# EAGLE design NHK_bldc (EAGLE 9.6.2)
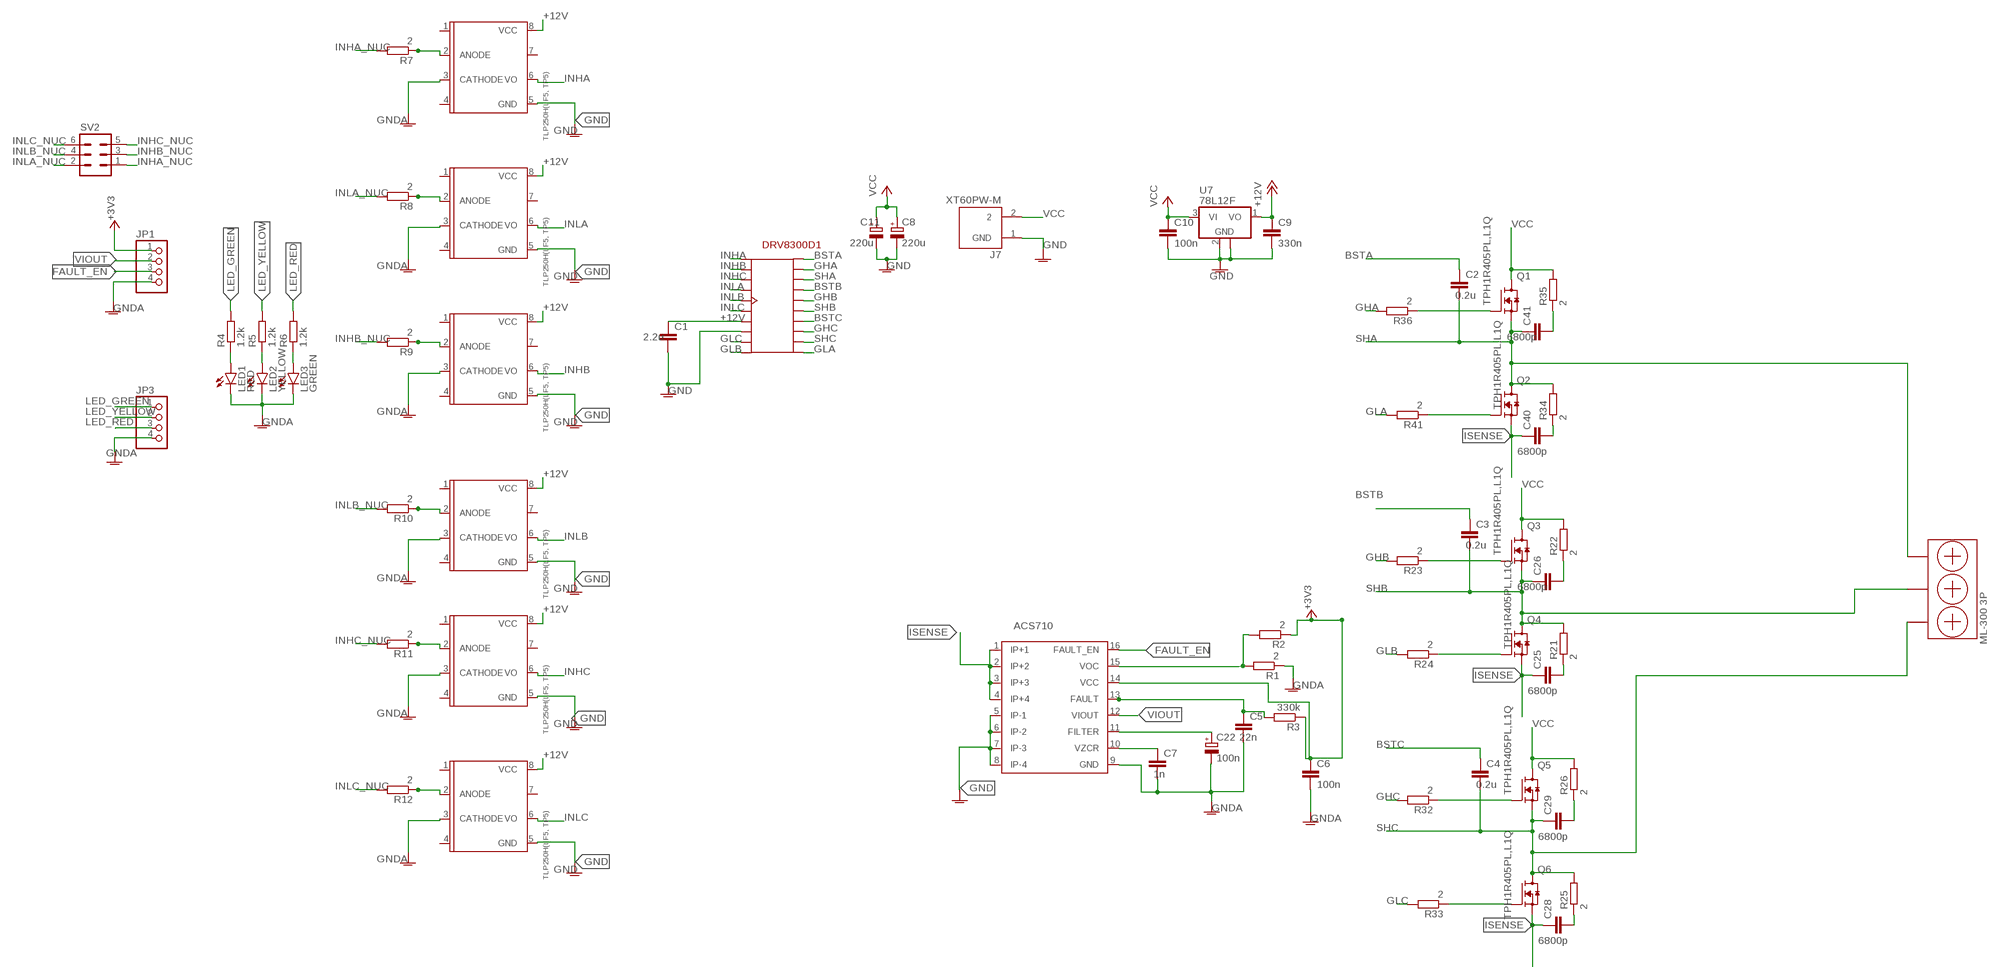
[diagram p0: schematic, sheet 1]

## Parts
C1  2.2u  C-EUC1206  [C1206]
C2  0.2u  C-EUC1206  [C1206]
C3  0.2u  C-EUC1206  [C1206]
C4  0.2u  C-EUC1206  [C1206]
C5  22n  C-EUC0603  [C0603]
C6  100n  C-EUC0603  [C0603]
C7  1n  C-EUC0603  [C0603]
C8  220u  CPOL-EUE5-10.5  [E5-10,5]
C9  330n  C-EUC0603  [C0603]
C10  100n  C-EUC0603  [C0603]
C11  220u  CPOL-EUE5-10.5  [E5-10,5]
C22  100n  CPOL-EUE2.5-5  [E2,5-5]
C25  6800p  C-EUC0603  [C0603]
C26  6800p  C-EUC0603  [C0603]
C28  6800p  C-EUC0603  [C0603]
C29  6800p  C-EUC0603  [C0603]
C40  6800p  C-EUC0603  [C0603]
C41  6800p  C-EUC0603  [C0603]
DRV8300D1  DRV8300D  [DRV8300D]
J7  XT60PW-M  [AMASS_XT60PW-M]
JP1  PINHD-1X4  [1X04]
JP3  PINHD-1X4  [1X04]
LED1  RED  LEDCHIP-LED0603  [CHIP-LED0603]
LED2  YELLOW  LEDCHIP-LED0603  [CHIP-LED0603]
LED3  GREEN  LEDCHIP-LED0603  [CHIP-LED0603]
ML-300-3P1  ML-300-3P  [ML300-3P]
Q1  TPH1R405PL,L1Q  [SOPADVANCE]
Q2  TPH1R405PL,L1Q  [SOPADVANCE]
Q3  TPH1R405PL,L1Q  [SOPADVANCE]
Q4  TPH1R405PL,L1Q  [SOPADVANCE]
Q5  TPH1R405PL,L1Q  [SOPADVANCE]
Q6  TPH1R405PL,L1Q  [SOPADVANCE]
R1  2  R-EU_R0603  [R0603]
R2  2  R-EU_R0603  [R0603]
R3  330k  R-EU_R0603  [R0603]
R4  1.2k  R-EU_R0603  [R0603]
R5  1.2k  R-EU_R0603  [R0603]
R6  1.2k  R-EU_R0603  [R0603]
R7  2  R-EU_R0603  [R0603]
R8  2  R-EU_R0603  [R0603]
R9  2  R-EU_R0603  [R0603]
R10  2  R-EU_R0603  [R0603]
R11  2  R-EU_R0603  [R0603]
R12  2  R-EU_R0603  [R0603]
R21  2  R-EU_R0603  [R0603]
R22  2  R-EU_R0603  [R0603]
R23  2  R-EU_R0603  [R0603]
R24  2  R-EU_R0603  [R0603]
R25  2  R-EU_R0603  [R0603]
R26  2  R-EU_R0603  [R0603]
R32  2  R-EU_R0603  [R0603]
R33  2  R-EU_R0603  [R0603]
R34  2  R-EU_R0603  [R0603]
R35  2  R-EU_R0603  [R0603]
R36  2  R-EU_R0603  [R0603]
R41  2  R-EU_R0603  [R0603]
SV2  MA03-2  [MA03-2]
U7  78L12F  [SOT89]
U8  TLP250H(LF5,TP5)  [TLP250H(LF5,TP5)]
U9  TLP250H(LF5,TP5)  [TLP250H(LF5,TP5)]
U10  TLP250H(LF5,TP5)  [TLP250H(LF5,TP5)]
U11  TLP250H(LF5,TP5)  [TLP250H(LF5,TP5)]
U12  TLP250H(LF5,TP5)  [TLP250H(LF5,TP5)]
U14  TLP250H(LF5,TP5)  [TLP250H(LF5,TP5)]
U$1  ACS710  [ACS710]

## Nets
+3V3: C6.1 JP1.1 R2.1 R3.1 U$1.14(VCC)
+12V: C1.1 C9.1 DRV8300D1.GVDD U7.1(VO) U8.8(VCC) U9.8(VCC) U10.8(VCC) U11.8(VCC) U12.8(VCC) U14.8(VCC)
AHG1: Q1.4(G) R36.1
AHG3: Q3.4(G) R23.1
AHG4: Q5.4(G) R32.1
ALG1: Q2.4(G) R41.1
ALG3: Q4.4(G) R24.1
ALG4: Q6.4(G) R33.1
BSTA: C2.1 DRV8300D1.BSTA
BSTB: C3.1 DRV8300D1.BSTB
BSTC: C4.1 DRV8300D1.BSTC
FAULT_EN: JP1.3 U$1.16(FAULT_EN)
GHA: DRV8300D1.GHA R36.2
GHB: DRV8300D1.GHB R23.2
GHC: DRV8300D1.GHC R32.2
GLA: DRV8300D1.GLA R41.2
GLB: DRV8300D1.GLB R24.2
GLC: DRV8300D1.GLC R33.2
GND: C1.2 C8.- C9.2 C10.2 C11.- DRV8300D1.GND J7.1(GND) U7.2(GND) U7.2@1(GND) U8.5(GND) U9.5(GND) U10.5(GND) U11.5(GND) U12.5(GND) U14.5(GND) U$1.5(IP-1) U$1.6(IP-2) U$1.7(IP-3) U$1.8(IP-4) ; supply symbol labelled GNDA
GNDA: C5.2 C6.2 C7.2 C22.- JP1.4 JP3.4 LED1.C LED2.C LED3.C R1.1 U8.3(CATHODE) U9.3(CATHODE) U10.3(CATHODE) U11.3(CATHODE) U12.3(CATHODE) U14.3(CATHODE) U$1.9(GND)
INHA: DRV8300D1.INHA U8.6(VO)
INHA_NUC: R7.2 SV2.1
INHB: DRV8300D1.INHB U10.6(VO)
INHB_NUC: R9.2 SV2.3
INHC: DRV8300D1.INHC U12.6(VO)
INHC_NUC: R11.2 SV2.5
INLA: DRV8300D1.INLA U9.6(VO)
INLA_NUC: R8.2 SV2.2
INLB: DRV8300D1.INLB U11.6(VO)
INLB_NUC: R10.2 SV2.4
INLC: DRV8300D1.INLC U14.6(VO)
INLC_NUC: R12.2 SV2.6
ISENSE: C25.1 C28.1 C40.1 Q2.1(S) Q2.2(S) Q2.3(S) Q4.1(S) Q4.2(S) Q4.3(S) Q6.1(S) Q6.2(S) Q6.3(S) U$1.1(IP+1) U$1.2(IP+2) U$1.3(IP+3) U$1.4(IP+4)
LED_GREEN: JP3.1 R4.2
LED_RED: JP3.3 R6.2
LED_YELLOW: JP3.2 R5.2
N$1: LED1.A R4.1
N$2: LED2.A R5.1
N$3: R1.2 R2.2 U$1.15(VOC)
N$4: C5.1 R3.2 U$1.13(FAULT)
N$5: C7.1 U$1.10(VZCR)
N$6: LED3.A R6.1
N$7: R7.1 U8.2(ANODE)
N$8: R8.1 U9.2(ANODE)
N$9: R9.1 U10.2(ANODE)
N$10: R10.1 U11.2(ANODE)
N$11: R11.1 U12.2(ANODE)
N$12: R12.1 U14.2(ANODE)
N$17: C22.+ U$1.11(FILTER)
N$36: C25.2 R21.1
N$37: C26.2 R22.1
N$39: C28.2 R25.1
N$40: C29.2 R26.1
N$42: C40.2 R34.1
N$43: C41.2 R35.1
SHA: C2.2 C41.1 DRV8300D1.SHA ML-300-3P1.P$1 Q1.1(S) Q1.2(S) Q1.3(S) Q2.5(D) Q2.6(D) Q2.7(D) Q2.8(D) Q2.9(D) R34.2
SHB: C3.2 C26.1 DRV8300D1.SHB ML-300-3P1.P$3 Q3.1(S) Q3.2(S) Q3.3(S) Q4.5(D) Q4.6(D) Q4.7(D) Q4.8(D) Q4.9(D) R21.2
SHC: C4.2 C29.1 DRV8300D1.SHC ML-300-3P1.P$5 Q5.1(S) Q5.2(S) Q5.3(S) Q6.5(D) Q6.6(D) Q6.7(D) Q6.8(D) Q6.9(D) R25.2
VCC: C8.+ C10.1 C11.+ J7.2 Q1.5(D) Q1.6(D) Q1.7(D) Q1.8(D) Q1.9(D) Q3.5(D) Q3.6(D) Q3.7(D) Q3.8(D) Q3.9(D) Q5.5(D) Q5.6(D) Q5.7(D) Q5.8(D) Q5.9(D) R22.2 R26.2 R35.2 U7.3(VI)
VIOUT: JP1.2 U$1.12(VIOUT)
Unconnected: U8.1 U8.4 U8.7 U9.1 U9.4 U9.7 U10.1 U10.4 U10.7 U11.1 U11.4 U11.7 U12.1 U12.4 U12.7 U14.1 U14.4 U14.7

## Library data of the parts
C1-C7 C9 C10 C25 C26 C28 C29 C40 C41 = rcl:C-EU: CAPACITOR, European symbol; SPICEPREFIX: C
C8 C11 C22 = rcl:CPOL-EU: POLARIZED CAPACITOR, European symbol; SPICEPREFIX: C
DRV8300D1 = DRV8300D:DRV8300D
J7 = con-xt:XT60PW-M; AVAILABILITY: Unavailable; MF: AMASS; MP: XT60PW-M; PACKAGE: Package Analog Devices; PRICE: None
JP1 JP3 = pinhead:PINHD-1X4: PIN HEADER
LED1-LED3 = led:LED: LED OSRAM: - CHIPLED LG R971, LG N971, LY N971, LG Q971, LY Q971, LO R971, LY R971 LH N974, LH R974 LS Q976, LO Q976, LY Q976 LO Q996 - Hyper CHIPLED LW Q18S LB Q993, LB Q99A, LB R99A - SideLED LS A670, LO A670, LY A670, LG A670, LP A670 LB A673, LV A673, LT A673, LW A673 LH A674 LY A675 LS A676, LA A676, LO A676, LY A676, LW A676 LS A679, LY A679, LG A679 - Hyper Micro SIDELED® LS Y876, LA Y876, LO Y876, LY Y876 LT Y87S - SmartLED LW L88C, LW L88S LB L89C, LB L89S, LG L890 LS L89K, LO L89K, LY L89K LS L896, LA L896, LO L896, LY L896 - TOPLED LS T670, LO T670, LY T670, LG T670, LP T670 LSG T670, LSP T670, LSY T670, LOP T670, LYG T670 LG T671, LOG T671, LSG T671 LB T673, LV T673, LT T673, LW T673 LH T674 LS T676, LA T676, LO T676, LY T676, LB T676, LH T676, LSB T676, LW T676 LB T67C, LV T67C, LT T67C, LS T67K, LO T67K, LY T67K, LW E67C LS E67B, LA E67B, LO E67B, LY E67B, LB E67C, LV E67C, LT E67C LW T67C LS T679, LY T679, LG T679 LS T770, LO T770, LY T770, LG T770, LP T770 LB T773, LV T773, LT T773, LW T773 LH T774 LS E675, LA E675, LY E675, LS T675 LS T776, LA T776, LO T776, LY T776, LB T776 LHGB T686 LT T68C, LB T68C - Hyper Mini TOPLED® LB M676 - Mini TOPLED Santana® LG M470 LS M47K, LO M47K, LY M47K Source: http://www.osram.convergy.de LUXEON: - LUMILED® LXK2-PW12-R00, LXK2-PW12-S00, LXK2-PW14-U00, LXK2-PW14-V00 LXK2-PM12-R00, LXK2-PM12-S00, LXK2-PM14-U00 LXK2-PE12-Q00, LXK2-PE12-R00, LXK2-PE12-S00, LXK2-PE14-T00, LXK2-PE14-U00 LXK2-PB12-K00, LXK2-PB12-L00, LXK2-PB12-M00, LXK2-PB14-N00, LXK2-PB14-P00, LXK2-PB14-Q00 LXK2-PR12-L00, LXK2-PR12-M00, LXK2-PR14-Q00, LXK2-PR14-R00 LXK2-PD12-Q00, LXK2-PD12-R00, LXK2-PD12-S00 LXK2-PH12-R00, LXK2-PH12-S00 LXK2-PL12-P00, LXK2-PL12-Q00, LXK2-PL12-R00 Source: www.luxeon.com KINGBRIGHT: KA-3528ASYC Source: www.kingbright.com
ML-300-3P1 = ML-300-3P:ML-300-3P
Q1-Q6 = toshiba:TPH1R405PL,L1Q; SPICEPREFIX: Q
R1-R12 R21-R26 R32-R36 R41 = rcl:R-EU_: RESISTOR, European symbol; SPICEPREFIX: R
SV2 = con-lstb:MA03-2: PIN HEADER; OC_FARNELL: unknown; OC_NEWARK: unknown
U7 = linear:78L*: POSITOIV-VOLTAGE REGULATORS Output up to 100 mA Source: Datasheet <http://focus.ti.com/lit/ds/symlink/ua78l05.pdf>
U8-U12 U14 = TLP250H(LF5, TP5):TLP250H(LF5,TP5)
U$1 = ACS710:ACS710

## Net classes
1 Power: width 0.8 mm, clearance 1 mm
2 FET: width 0.1 mm, clearance 1 mm

## Board
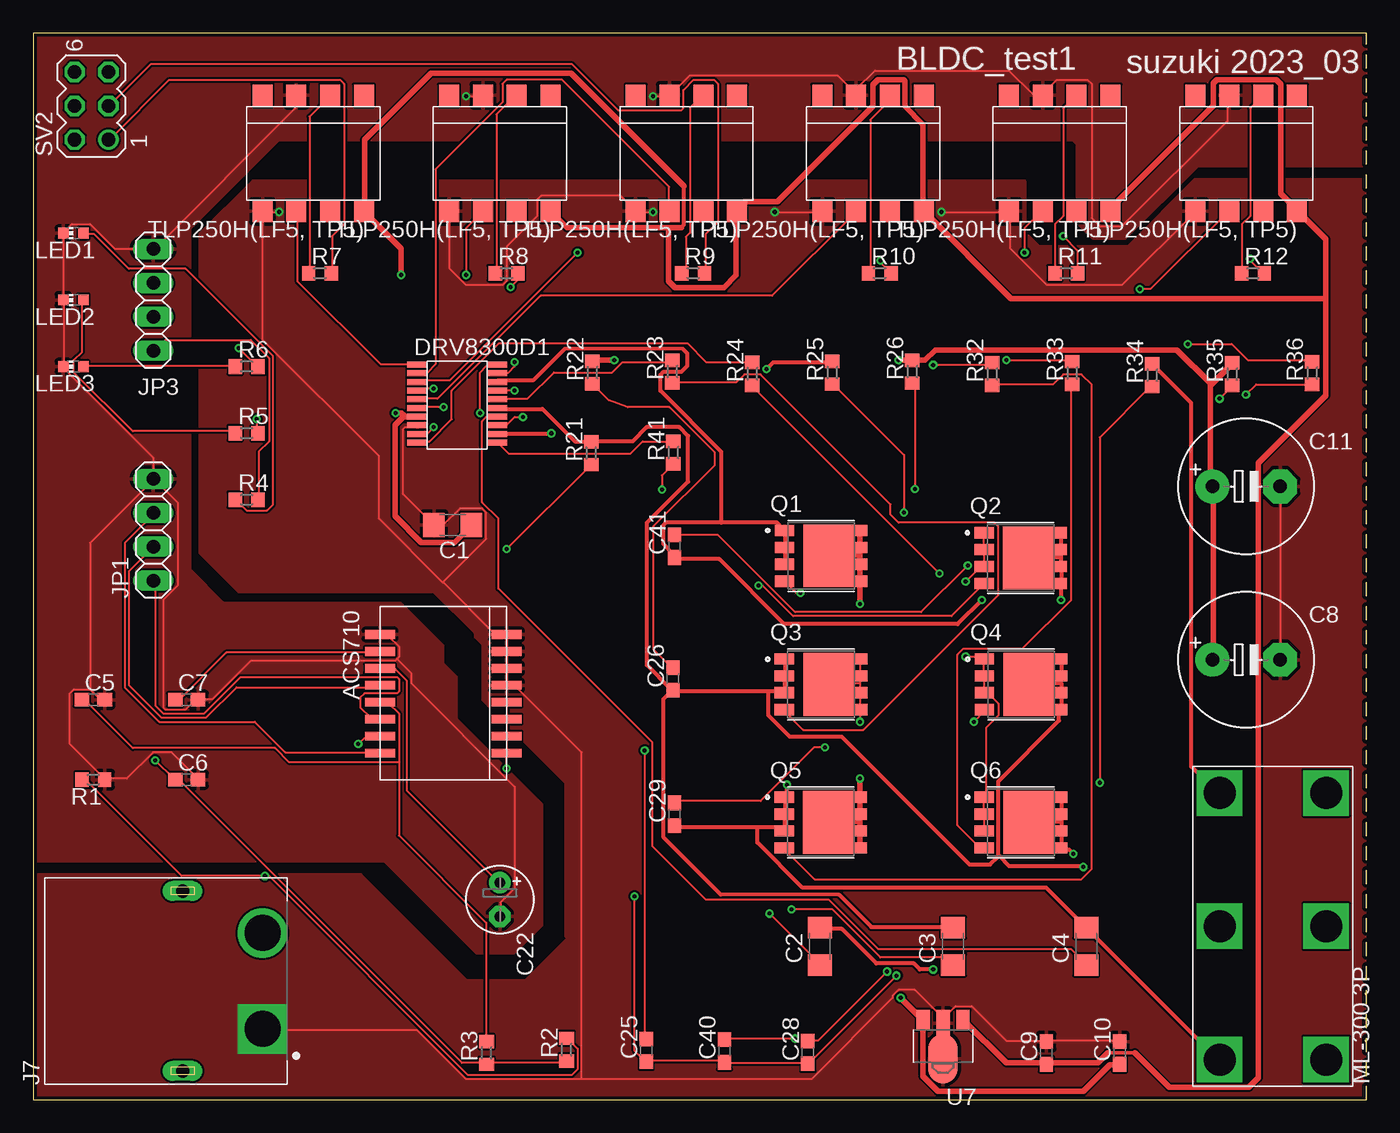
[diagram p1: board, top side]
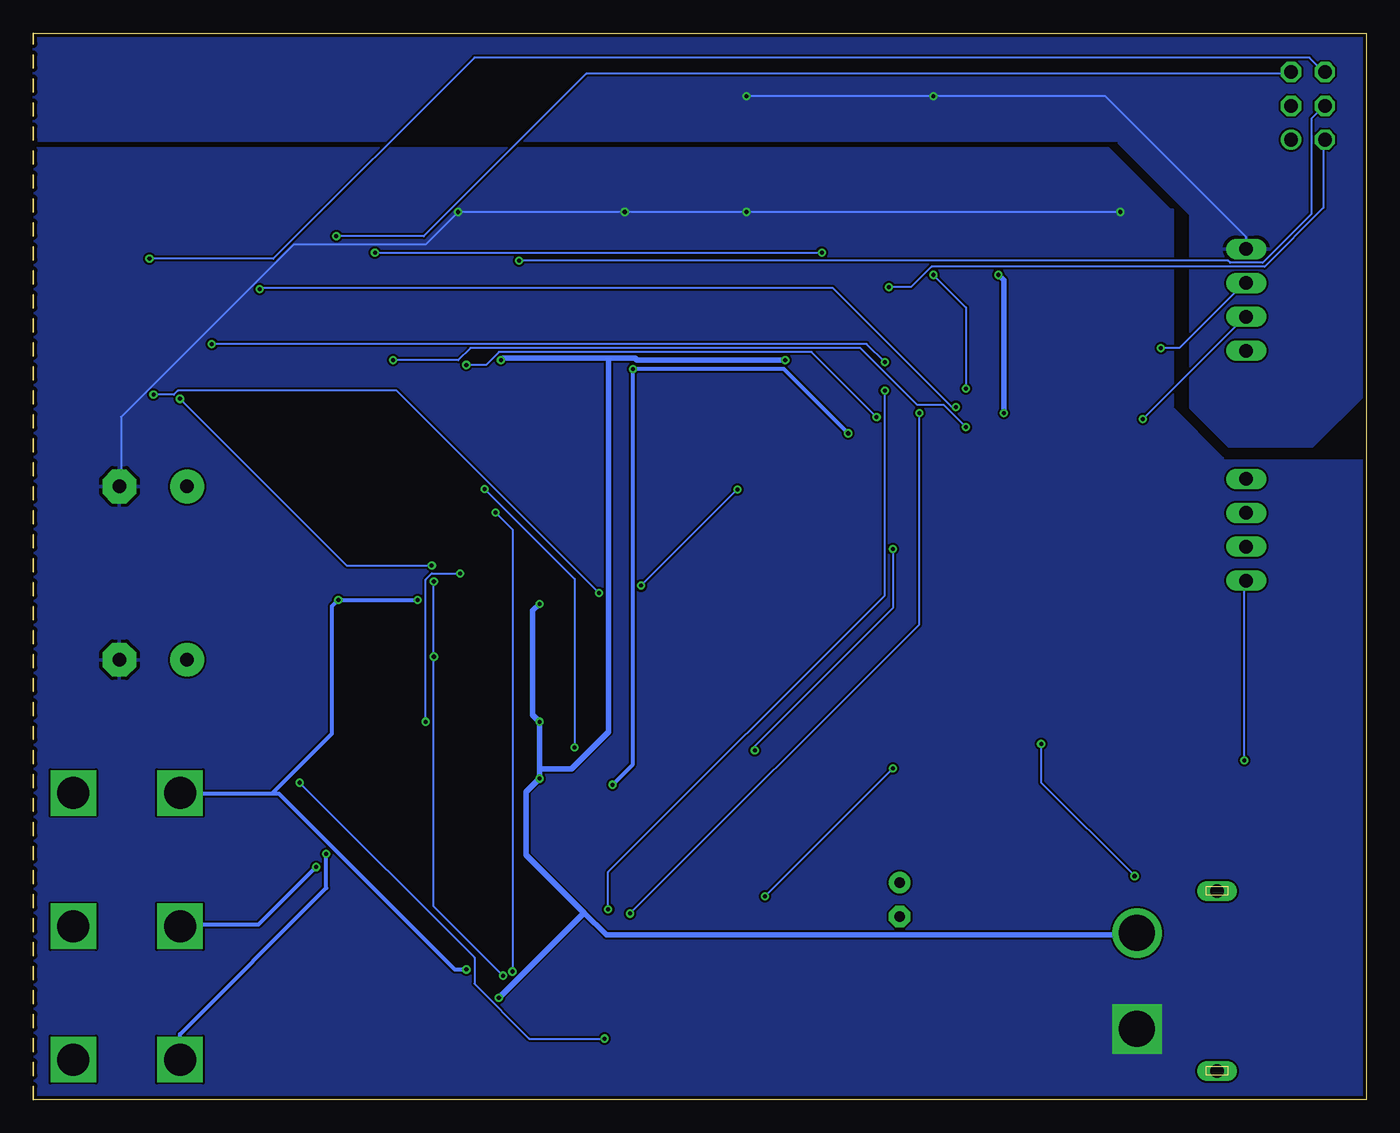
[diagram p2: board, bottom side, seen from below]

Size 100 x 80 mm. Coordinates in mm from the lower left corner, seen from the top.
Outline: 0,0 100,0 100,80 0,80 0,0
Copper layers (1*16): Top 0.035mm / dielectric 1.5mm / Bottom 0.035mm
Design rules "SeeedStudio_2layer_DRU_no_angle_20140221": minimum track width 6mil, minimum drill 12mil, track to track 6mil, track to pad 6mil, pad to pad 6mil, via to via 6mil, smd to smd 0mil, copper to edge 10mil, drill to drill 10mil, minimum pad ring 10mil, minimum via ring 6mil, stop-mask expansion 2mil, vias tented up to drill 100mil, thermal gap 10mil

### Footprints (pad centres in the part's own frame; a part is rotated, then mirrored left to right if it is on the bottom)
C1206 = smd 1.6 x 1.8: 1 -1.4,0; 2 1.4,0
C0603 = smd 1.1 x 1: 1 -0.85,0; 2 0.85,0
E5-10,5 = drill 1.016 pad 2.54: + -2.54,0 | drill 1.016 pad 2.54 octagon: - 2.54,0
E2,5-5 = drill 0.813 pad 1.6: + -1.27,0 | drill 0.813 pad 1.6 octagon: - 1.27,0
DRV8300D = smd 1.5 x 0.45: BSTA 5.25,6.325; BSTB 5.25,4.375; BSTC 5.25,2.425; GHA 5.25,5.675; GHB 5.25,3.725; GHC 5.25,1.775; GLA 5.25,0.475; GLB -0.75,0.475; GLC -0.75,1.125; GND -0.75,1.775; GVDD -0.75,2.425; INHA -0.75,6.325; INHB -0.75,5.675; INHC -0.75,5.025; INLA -0.75,4.375; INLB -0.75,3.725; INLC -0.75,3.075; SHA 5.25,5.025; SHB 5.25,3.075; SHC 5.25,1.125
AMASS_XT60PW-M = drill 2.7 square: 1 -3.6,-6 | drill 2.7: 2 3.6,-6 | drill 1 pad 1.2 long: S1 -6.75,0; S2 6.75,0
1X04 = drill 1.016 long: 1 -3.81,0; 2 -1.27,0; 3 1.27,0; 4 3.81,0
CHIP-LED0603 = smd 0.8 x 0.8: A 0,-0.75; C 0,0.75
ML300-3P = drill 2.4 square: P$1 0,0; P$2 0,8; P$3 10,0; P$4 10,8; P$5 20,0; P$6 20,8
SOPADVANCE = smd 1.45 x 0.85: 1 -2.75,1.905; 2 -2.75,0.635; 3 -2.75,-0.635; 4 -2.75,-1.905 | smd 1.05 x 0.85: 5 2.95,-1.905; 6 2.95,-0.635; 7 2.95,0.635; 8 2.95,1.905 | smd 3.75 x 4.7: 9 0.55,0
R0603 = smd 1 x 1.1: 1 -0.85,0; 2 0.85,0
MA03-2 = drill 1.016: 1 -2.54,-1.27 | drill 1.016 octagon: 2 -2.54,1.27; 3 0,-1.27; 4 0,1.27; 5 2.54,-1.27; 6 2.54,1.27
SOT89 = smd 1 x 1.5: 1 -1.499,-1.981; 3 1.499,-1.981 | smd 1 x 2: 2 0,-1.727 | smd 2.2 x 3.7: 2@1 0,0.94
TLP250H(LF5,TP5) = smd 1.5 x 1.6: 1 -3.81,-4.35; 2 -1.27,-4.35; 3 1.27,-4.35; 4 3.81,-4.35; 5 3.81,4.35; 6 1.27,4.35; 7 -1.27,4.35; 8 -3.81,4.35
ACS710 = smd 0.65 x 2.25: 1 0,0; 2 1.27,0; 3 2.54,0; 4 3.81,0; 5 5.08,0; 6 6.35,0; 7 7.62,0; 8 8.89,0; 9 8.89,9.5; 10 7.62,9.5; 11 6.35,9.5; 12 5.08,9.5; 13 3.81,9.5; 14 2.54,9.5; 15 1.27,9.5; 16 0,9.5

### Placement (x,y rotation side)
C1  31.46,43.12 180 top
C2  59,11.5 90 top
C3  69,11.5 90 top
C4  79,11.5 90 top
C5  4.5,30 0 top
C6  11.5,24 0 top
C7  11.5,30 0 top
C8  91,33 0 top
C9  76,3.5 90 top
C10  81.5,3.5 90 top
C11  91,46 0 top
C22  35,15 270 top
C25  45.99,3.69 90 top
C26  47.99,31.56 90 top
C28  58.11,3.54 90 top
C29  48.11,21.41 90 top
C40  51.86,3.65 90 top
C41  48.11,41.52 90 top
DRV8300D1  29.55,48.82 0 top
J7  11.2,8.89 90 top
JP1  9,42.75 90 top
JP3  9,60 90 top
LED1  3,65 90 top
LED2  3,60 90 top
LED3  3,55 90 top
ML-300-3P1  89,23 270 top
Q1  59.1,40.79 0 top
Q2  74.08,40.63 0 top
Q3  59.09,31.15 0 top
Q4  74.1,31.15 0 top
Q5  59.08,20.79 0 top
Q6  74.09,20.79 0 top
R1  4.5,24 180 top
R2  40,3.75 90 top
R3  34,3.5 90 top
R4  16,45 0 top
R5  16,50 0 top
R6  16,55 0 top
R7  21.5,62 0 top
R8  35.5,62 0 top
R9  49.5,62 0 top
R10  63.5,62 0 top
R11  77.5,62 0 top
R12  91.5,62 0 top
R21  41.86,48.49 90 top
R22  41.94,54.54 90 top
R23  47.94,54.62 90 top
R24  53.94,54.45 90 top
R25  59.94,54.53 90 top
R26  65.94,54.61 90 top
R32  71.94,54.44 90 top
R33  77.94,54.52 90 top
R34  83.94,54.35 90 top
R35  89.94,54.43 90 top
R36  95.94,54.51 90 top
R41  48.02,48.54 90 top
SV2  4.37,74.56 90 top
U7  68.25,4 180 top
U8  21,71 180 top
U9  35,71 180 top
U10  49,71 180 top
U11  63,71 180 top
U12  77,71 180 top
U14  91,71 180 top
U$1  35.5,26 90 top

### Tracks (layer width: path | path; a pad name or v marks a point on that pad's centre or on a via)
+3V3  (via drill 0.3)
  Top 0.152: U$1.14 25.91,28.65 25.3,28.65 24.54,29.41 24.54,30.18 24.84,30.48 27.28,30.48 27.43,30.63 27.43,31.55 27.28,31.7 15.54,31.7 12.8,28.96 9.75,28.96 9.14,29.57 9.14,38.86 JP1.1 | R2.1 39.93,2.9 39.78,2.74 34.14,2.74 R3.1 33.98,2.74 32.16,2.74 10.97,23.93 10.67,23.93 C6.1 10.52,24.08 v9.14,25.45
  Bottom 0.152: v9.14,25.45 9.14,38.86 JP1.1
+12V  (via drill 0.3)
  Top 0.152: 28.65,51.21 DRV8300D1.GVDD | 32.77,42.98 C1.1 | 24.84,66.75 U8.8 24.84,66.6 | 38.86,66.6 U9.8 | 52.73,66.6 U10.8 | 66.75,66.75 U11.8 | 75.89,2.74 C9.1 76.05,2.74 | 69.8,5.94 U7.1 | 80.92,66.96 80.92,66.75 U12.8 | 94.79,66.75 U14.8 94.94,66.6
  Top 0.254: 82.63,3.5 80.62,3.5
  Top 0.305: 48.82,68.52 48.82,65.63 48.62,65.43
  Top 0.406: 28.65,51.21 27.99,51.21 27.87,51.33 27.84,51.31 | 27.84,51.31 27.13,50.6 27.13,43.79 29.11,41.81 31.6,41.81 32.77,42.98 | 24.84,66.75 24.84,72.02 29.83,77.01 40.33,77.01 48.82,68.52 | 47.65,65.43 40.03,65.43 38.86,66.6 | 47.65,65.43 48.62,65.43 | 52.73,66.6 52.73,61.84 51.8,60.91 48.16,60.91 47.65,61.42 47.65,65.43 | 66.75,66.75 66.75,73.16 65.38,74.53 65.38,76.4 65.28,76.5 63.35,76.5 62.99,76.14 62.99,74.52 55.82,67.35 53.31,67.35 U10.8 | 27.84,51.31 27.63,51.51 v27.18,51.51 | v27.58,61.87 27.58,63.86 24.84,66.6 | 75.89,2.74 73,2.74 69.8,5.94 | 80.92,66.96 88.55,74.58 88.55,76.25 88.8,76.5 93.27,76.5 93.58,76.19 93.58,67.97 94.79,66.75 | 76.05,2.74 79.86,2.74 80.62,3.5 | 82.63,3.5 85.22,0.91 91.18,0.91 91.9,1.63 91.9,47.76 96.97,52.84 96.97,60.1 | 96.97,60.1 96.97,64.57 94.94,66.6 | U11.8 73.36,60.1 96.97,60.1 | U11.8
  Bottom 0.406: v27.58,61.87 27.18,61.47 v27.18,51.51
AHG1  (via drill 0.3)
  Top 0.152: v90.98,52.88 91.75,53.65 95.86,53.65 R36.1 | v57.55,38 57.25,38 56.39,38.86 Q1.4
  Bottom 0.152: v90.98,52.88 89.46,52.88 89.15,53.19 72.74,53.19 v57.55,38
AHG3
  Top 0.152: R23.1 48.01,53.8 52.73,53.8 53.34,54.41 54.56,54.41 64.31,44.65 64.31,43.89 64.92,43.28 72.08,43.28 72.39,42.98 72.39,37.85 62.28,27.74 57.76,27.74 56.39,29.11 Q3.4
AHG4
  Top 0.152: R32.1 72.08,53.65 76.5,53.65 77.27,54.41 78.64,54.41 79.4,53.65 79.4,17.29 78.64,16.53 58.61,16.53 56.39,18.75 Q5.4
ALG1  (via drill 0.3)
  Top 0.152: R41.1 47.16,46.83 v47.16,45.77 | v54.41,38.56 54.71,38.56 57,36.27 68.89,36.27 71.32,38.71 Q2.4
  Bottom 0.152: v47.16,45.77 47.2,45.77 v54.41,38.56
ALG3  (via drill 0.3)
  Top 0.152: v67.97,39.47 53.95,53.49 R24.1 | v70.56,28.35 71.32,29.11 Q4.4
  Bottom 0.152: v67.97,39.47 70.1,39.47 70.56,39.01 v70.56,28.35
ALG4
  Top 0.152: R33.1 77.88,53.65 77.88,37.49 74.22,33.83 69.8,33.83 69.34,33.38 69.34,20.57 71.02,18.9 71.32,18.9 Q6.4
BSTA  (via drill 0.3)
  Top 0.152: v33.53,51.51 33.53,54.56 33.98,55.02 34.75,55.02 DRV8300D1.BSTA | v55.24,13.95 58.98,10.21 C2.1
  Bottom 0.152: v33.53,51.51 33.53,35.66 v55.24,13.95
BSTB  (via drill 0.3)
  Top 0.152: v36.12,53.19 34.9,53.19 DRV8300D1.BSTB | v56.87,14.28 59.94,14.28 63.56,10.66 68.43,10.66 68.89,10.21 C3.1
  Bottom 0.152: v36.12,53.19 36.12,37.83 56.87,17.08 v56.87,14.28
BSTC
  Top 0.152: DRV8300D1.BSTC 34.75,51.21 33.98,51.21 33.68,50.9 33.68,44.81 34.9,43.59 34.9,38.34 46.44,26.8 46.44,19.01 50.46,14.99 59.69,14.99 63.4,11.28 77.88,11.28 78.94,10.21 C4.1
FAULT_EN
  Top 0.152: U$1.16 25.91,26.06 18.9,26.06 16.61,28.35 9.45,28.35 6.86,30.94 6.86,41.76 8.99,43.89 JP1.3
GHA  (via drill 0.3)
  Top 0.152: v86.61,56.69 89.92,56.69 91.14,55.47 95.86,55.47 R36.2 | v36.12,55.32 36.12,55.02 35.66,54.56 34.9,54.56 DRV8300D1.GHA
  Bottom 0.152: v86.61,56.69 37.49,56.69 v36.12,55.32
GHB
  Top 0.152: R23.2 47.85,55.32 44.2,55.32 43.43,54.56 39.06,54.56 37.08,52.58 34.9,52.58 DRV8300D1.GHB
GHC  (via drill 0.3)
  Top 0.152: R32.2 71.77,55.12 v67.51,55.12 | v36.73,51.21 36.12,51.21 35.51,50.6 34.9,50.6 DRV8300D1.GHC
  Bottom 0.152: v67.51,55.12 66.04,55.12 65.08,56.08 41.6,56.08 v36.73,51.21
GLA
  Top 0.152: R41.2 48.01,49.38 45.72,49.38 44.81,48.46 35.66,48.46 34.9,49.23 DRV8300D1.GLA
GLB
  Top 0.152: R24.2 53.8,55.32 50.49,55.32 49.07,56.74 34.95,56.74 31.39,53.19 31.39,51.05 29.72,49.38 28.8,49.38 DRV8300D1.GLB
GLC  (via drill 0.3)
  Top 0.152: v73,55.47 77.88,55.47 R33.2 | v30.02,50.44 29.57,49.99 28.8,49.99 DRV8300D1.GLC
  Bottom 0.152: v73,55.47 68.12,55.47 67.21,56.39 37.95,56.39 33.68,52.12 31.7,52.12 v30.02,50.44
GND  (via drill 0.3)
  Top 0.152: C8.- 93.57,33.07 93.57,45.87 C11.- | U14.5 87.17,66.6 81.69,61.11 76.05,61.11 73.3,63.86 73.3,66.6 U12.5 73.15,66.6 v68.12,66.6 | U9.5 31.24,66.6 31.24,62.33 32.46,61.11 35.2,61.11 35.51,61.42 35.51,64.01 37.8,66.29 37.8,67.51 38.1,67.82 44.04,67.82 45.11,66.75 U10.5 45.26,66.6 v46.48,66.6 | v55.63,66.6 59.13,66.6 U11.5 | DRV8300D1.GND 28.65,50.44 27.89,50.44 27.74,50.29 27.74,45.41 30.02,43.13 C1.2 30.18,43.13 30.79,43.13 32,44.35 33.68,44.35 33.98,44.04 33.98,42.06 30.74,38.82 | 17.22,66.6 17.22,57 25.93,48.29 25.93,43.58 30.71,38.79 30.74,38.82 | 30.74,38.82 34.61,34.95 U$1.8 35.51,34.75 35.51,33.68 U$1.7 35.51,33.53 35.51,32.46 U$1.6 35.51,32.31 U$1.5 35.51,30.94 36.27,30.94 41.15,26.06 41.15,1.52 | C10.2 81.38,4.42 76.05,4.42 C9.2 75.89,4.42 73,4.42 70.41,7.01 69.19,7.01 68.28,6.1 | U7.2 68.28,5.64 68.28,3.2 U7.2@1 | 68.28,6.1 68.28,5.79 U7.2 | 41.15,1.52 58.37,1.52 64.47,7.62 64.47,7.77 64.92,8.23 66.14,8.23 68.28,6.1 | 41.15,1.52 32.46,1.52 28.8,5.18 17.22,5.18 J7.1 | 68.28,6.1 U7.2 | 17.22,66.6 v18.44,66.6 | 17.22,66.6 U8.5
  Bottom 0.152: C11.- 93.42,46.02 93.42,51.21 80.47,64.16 70.56,64.16 v68.12,66.6 v55.63,66.6 v46.48,66.6 v18.44,66.6
  pour Top: 99.95,69.05 87.1,69.05 82.1,64.05 75.55,64.05 75.5,64 74.45,65.05 74.45,68.9 74.4,68.95 16.45,68.95 12.45,64.95 12.45,41 15.35,38.1 30,38.1 33.1,35 33.1,34.7 33.65,34.15 33.65,30 39.85,23.8 39.9,23.8 39.9,12.25 40.05,12.1 36.9,8.95 32.55,8.95 24.6,16.9 0.1,16.9 0.1,0.05 99.95,0.05
  pour Bottom: 99.9,71.4 19.35,71.4 14.75,66.8 14.5,66.8 14.5,52 14.55,51.95 10.75,48.15 10.75,48 0.1,48 0.1,0.1 99.9,0.1
GNDA  (via drill 0.3)
  Top 0.152: U14.3 89.61,75.29 89.61,73.46 81.69,65.53 80.01,65.53 79.4,66.14 79.4,76.2 79.1,76.5 76.81,76.5 75.74,75.44 U12.3 75.59,75.44 74.98,75.44 73.21,77.21 63.15,77.21 61.73,75.79 U11.3 61.72,75.44 60.35,76.81 49.23,76.81 47.85,75.44 U10.3 47.7,75.29 v46.48,75.29 | 27.28,33.07 27.43,33.22 27.43,33.98 26.67,34.75 26.06,34.75 U$1.9 | 27.28,33.07 27.13,32.92 16.31,32.92 13.41,30.02 12.5,30.02 C7.2 12.34,29.87 12.04,29.87 11.43,29.26 9.91,29.26 9.75,29.41 9.75,37.49 10.82,38.56 10.82,44.81 9.14,46.48 JP1.4 | 27.28,33.07 28.35,32 28.35,31.24 36.12,23.47 36.12,15.85 35.05,14.78 35.05,13.87 C22.- | U8.3 19.66,75.29 19.66,74.37 9.14,63.86 JP3.4 8.99,63.86 6.1,63.86 4.27,65.68 2.9,65.68 2.29,65.08 LED1.C 2.29,64.92 2.29,60.05 LED2.C 2.29,59.89 2.29,55.02 LED3.C 2.29,54.86 8.99,48.16 8.99,46.63 JP1.4 | v32.46,75.29 33.68,75.29 U9.3 | C6.2 12.34,24.08 10.36,26.06 8.99,26.06 7.01,24.08 5.49,24.08 R1.1 5.33,24.08 2.74,26.67 2.74,30.48 3.05,30.79 4.27,30.79 | 4.27,30.79 5.03,30.02 5.33,30.02 C5.2 | 4.27,30.79 4.27,41.76 8.99,46.48 JP1.4
  Bottom 0.152: JP3.4 9,64.71 19.57,75.29 v32.46,75.29 v46.48,75.29
  pour Top: 0.1,79.75 100,79.75 100,70 87.35,70 81.9,64.55 79.5,64.55 78.3,65.75 78.3,71.65 78,71.95 18.4,71.95 11.75,65.3 11.75,39.8 14.25,37.3 27.55,37.3 30.75,34.1 30.75,32.75 31.75,31.75 31.75,28.6 38.15,22.2 38.15,13.05 36.05,10.95 33.25,10.95 26.35,17.85 0.1,17.85
  pour Bottom: 99.95,79.75 0.05,79.75 0.05,52.95 4.05,48.95 10.3,48.95 13.2,51.85 13.2,66.35 18.55,71.7 18.55,71.9 99.95,71.9
INHA
  Top 0.152: DRV8300D1.INHA 28.65,55.17 26.06,55.17 19.81,61.42 19.81,66.6 U8.6
INHA_NUC
  Top 0.152: R7.2 22.4,62.03 22.4,64.77 23.32,65.68 23.32,76.2 23.01,76.5 10.21,76.5 5.79,72.08 SV2.1
INHB
  Top 0.152: DRV8300D1.INHB 28.8,54.56 29.57,54.56 30.18,55.17 30.18,69.8 35.2,74.83 35.2,76.2 35.51,76.5 39.67,76.5 47.7,68.48 47.7,66.75 U10.6
INHB_NUC
  Top 0.152: R9.2 50.44,62.03 50.44,64.92 51.36,65.84 51.36,76.2 51.05,76.5 49.53,76.5 48.77,75.74 48.77,74.37 48.62,74.22 43.87,74.22 40.38,77.71 8.83,77.71 5.79,74.68 SV2.3
INHC  (via drill 0.3)
  Top 0.152: v40.84,63.55 31.24,53.95 28.8,53.95 DRV8300D1.INHC | v74.37,63.55 74.37,65.38 75.59,66.6 U12.6
  Bottom 0.152: v74.37,63.55 v40.84,63.55
INHC_NUC  (via drill 0.3)
  Top 0.152: v77.27,64.77 78.33,63.7 78.33,62.03 R11.2
  Bottom 0.152: v77.27,64.77 70.71,64.77 58.52,76.96 5.79,76.96 SV2.5
INLA  (via drill 0.3)
  Top 0.152: v30.02,53.34 28.8,53.34 DRV8300D1.INLA | v32.46,61.87 32.46,65.38 33.68,66.6 U9.6
  Bottom 0.152: v30.02,53.34 30.02,59.44 v32.46,61.87
INLA_NUC  (via drill 0.3)
  Top 0.152: v35.81,60.96 36.27,61.42 36.27,61.87 R8.2
  Bottom 0.152: v35.81,60.96 34.14,60.96 32.61,62.48 7.62,62.48 3.2,66.9 3.2,71.93 SV2.2
INLB
  Top 0.152: DRV8300D1.INLB 28.8,52.58 30.33,52.58 38.06,60.31 55.43,60.31 61.72,66.6 U11.6
INLB_NUC  (via drill 0.3)
  Top 0.152: v63.55,62.94 63.55,62.79 64.31,62.03 R10.2
  Bottom 0.152: v63.55,62.94 10.36,62.94 10.21,62.79 7.77,62.79 4.12,66.45 4.12,73.61 3.2,74.52 SV2.4
INLC  (via drill 0.3)
  Top 0.152: v30.79,51.97 28.8,51.97 DRV8300D1.INLC | v83.01,60.81 83.82,60.81 89.61,66.6 U14.6
  Bottom 0.152: v30.79,51.97 31.09,51.97 40.03,60.91 82.91,60.91 v83.01,60.81
INLC_NUC  (via drill 0.3)
  Top 0.152: v91.29,63.09 91.29,62.94 92.2,62.03 R12.2
  Bottom 0.152: v91.29,63.09 81.99,63.09 66.9,78.18 4.27,78.18 3.2,77.11 SV2.6
ISENSE  (via drill 0.3)
  Top 0.152: Q2.1 71.32,42.52 71.32,41.3 Q2.2 71.32,41.15 71.32,40.08 Q2.3 71.32,39.93 71.02,39.93 v69.95,38.86 | Q6.3 71.32,20.27 71.32,21.34 Q6.2 71.32,21.49 71.32,22.55 Q6.1 71.48,22.71 71.48,27.89 72.39,28.8 72.39,29.72 71.48,30.63 Q4.3 71.32,30.63 71.32,31.7 Q4.2 71.32,31.85 71.32,32.92 Q4.1 71.32,33.07 71.17,33.22 v69.95,33.22 | U$1.4 35.51,29.72 35.51,28.65 U$1.3 35.51,28.5 U$1.2 35.51,27.13 35.51,26.06 U$1.1 35.51,25.91 v35.51,24.84 | v45.11,15.24 45.11,3.66 45.87,2.9 C25.1 46.02,2.9 51.82,2.9 C40.1 51.97,2.74 58.06,2.74 C28.1 58.22,2.74 v64.77,9.3
  Bottom 0.152: v69.95,38.86 v69.95,33.22 69.95,14.48 v64.77,9.3 | v45.11,15.24 v35.51,24.84
LED_GREEN
  Top 0.152: R4.2 16.92,45.11 16.92,48.62 17.68,49.38 17.68,55.63 16.31,57 9.91,57 9.14,56.24 JP3.1
LED_RED  (via drill 0.3)
  Top 0.152: v15.39,56.39 16.76,55.02 R6.2
  Bottom 0.152: v15.39,56.39 14.02,56.39 9.14,61.27 JP3.3
LED_YELLOW  (via drill 0.3)
  Top 0.152: v16.76,51.05 16.76,50.14 R5.2
  Bottom 0.152: v16.76,51.05 9.14,58.67 JP3.2
N$1
  Top 0.152: LED1.A 3.81,64.92 4.57,64.92 7.16,62.33 11.43,62.33 17.98,55.78 17.98,44.65 17.53,44.2 16,44.2 15.24,44.96 R4.1
N$2
  Top 0.152: LED2.A 3.66,59.89 3.66,56.08 3.05,55.47 3.05,54.56 7.47,50.14 15.09,50.14 R5.1
N$3  (via drill 0.3)
  Top 0.152: R1.2 3.66,23.93 3.96,23.93 11.12,16.76 v17.37,16.76 17.68,16.76 32.61,1.83 40.39,1.83 40.84,2.29 40.84,3.81 40.08,4.57 R2.2 | v24.38,26.67 24.84,27.13 25.91,27.13 U$1.15
  Bottom 0.152: v24.38,26.67 24.38,23.77 v17.37,16.76
N$4
  Top 0.152: 27.43,25.3 27.43,28.96 26.67,29.72 26.06,29.72 U$1.13 | 27.43,25.3 27.43,19.81 33.98,13.26 33.98,4.42 R3.2 | 27.43,25.3 19.2,25.3 18.14,26.36 7.47,26.36 3.96,29.87 3.66,29.87 C5.1
N$5
  Top 0.152: C7.1 10.67,30.02 10.97,30.02 14.48,33.53 25.91,33.53 U$1.10
N$6
  Top 0.152: LED3.A 3.81,55.02 15.09,55.02 R6.1
N$7
  Top 0.152: R7.1 20.73,62.03 20.73,73.76 22.25,75.29 U8.2
N$8
  Top 0.152: R8.1 34.75,62.03 34.75,73.91 36.12,75.29 U9.2
N$9
  Top 0.152: R9.1 48.97,62.07 48.97,64.73 49.27,65.03 49.27,74.42 50.14,75.29 U10.2
N$10
  Top 0.152: U11.2 64.27,75 62.79,73.51 62.79,62.03 R10.1
N$11
  Top 0.152: R11.1 76.66,62.03 76.66,65.68 77.27,66.29 77.27,74.37 78.18,75.29 U12.2
N$12
  Top 0.152: R12.1 90.68,62.03 90.68,65.68 91.29,66.29 91.29,74.37 92.2,75.29 U14.2
N$17
  Top 0.152: U$1.11 26.06,32.31 27.13,32.31 28.04,31.39 28.04,23.16 34.9,16.31 C22.+
N$36  (via drill 0.3)
  Top 0.152: v45.87,26.2 45.87,4.57 C25.2 | v35.51,41.3 41.76,47.55 R21.1
  Bottom 0.152: v45.87,26.2 45.87,26.52 35.51,36.88 v35.51,41.3
N$37
  Top 0.152: R22.1 43.16,52.47 44.58,51.95 47.72,51.95 51.12,48.54 51.12,47.62 46.54,43.03 46.54,33.78 47.85,32.46 C26.2
N$39  (via drill 0.3)
  Top 0.152: v64.06,9.6 58.88,4.42 58.22,4.42 C28.2 | v65.32,44.04 65.32,48.37 60.05,53.65 R25.1
  Bottom 0.152: v64.06,9.6 64.06,42.78 v65.32,44.04
N$40  (via drill 0.3)
  Top 0.152: v59.38,26.42 58.58,26.42 54.56,22.4 48.16,22.4 C29.2 | R26.1 66.14,53.56 v66.14,45.82
  Bottom 0.152: v59.38,26.42 59.38,39.07 v66.14,45.82
N$42  (via drill 0.3)
  Top 0.152: v57.15,4.57 51.97,4.57 C40.2 | v80.01,23.77 80.01,49.68 83.82,53.49 R34.1
  Bottom 0.152: v57.15,4.57 62.79,4.57 66.9,8.69 66.9,10.67 v80.01,23.77
N$43  (via drill 0.3)
  Top 0.152: v70.1,40.08 66.6,36.58 57.15,36.58 51.36,42.37 48.16,42.37 C41.2 | v89,52.58 89.92,53.49 R35.1
  Bottom 0.152: v70.1,40.08 76.5,40.08 v89,52.58
SHA  (via drill 0.3)
  Top 0.152: 56.39,40.23 Q1.3 | 56.39,41.3 Q1.2 56.39,41.45 | 48.01,40.95 48.01,40.69 C41.1 48.16,40.54 | 56.24,42.82 Q1.1 56.39,42.67 | 34.9,53.95 DRV8300D1.SHA | 77.11,38.86 Q2.5 77.11,38.71 | 77.11,39.93 Q2.6 77.11,40.08 | 77.11,41.15 Q2.7 77.11,41.3 | 77.11,42.52 Q2.8 | 74.68,40.69 Q2.9 | 83.97,55.16 83.97,55.17 R34.2 | 88.85,23.01 ML-300-3P1.P$1 | 59.13,12.8 C2.2
  Top 0.254: 48.72,56.34 39.88,56.34
  Top 0.305: 56.39,41.3 56.39,40.23 | 48.01,40.95 47.24,41.71 47.24,43.08 47.45,43.28 51.63,43.28 | 51.63,43.28 55.78,43.28 56.24,42.82 | 34.9,53.95 37.49,53.95 39.88,56.34 | 48.72,56.34 49.07,55.98 49.07,55.06 48.61,54.61 47.29,54.61 47.04,54.36 47.04,53.18 51.63,48.59 51.63,43.28 | 56.39,42.67 56.39,41.45 | 77.11,39.93 77.11,38.86 | 77.11,40.08 77.11,40.69 | 77.11,40.69 77.11,41.15 | 77.11,41.3 77.11,42.52 | 74.68,40.69 77.11,40.69 | 83.97,55.16 86.87,52.27 86.87,24.99 88.85,23.01 | 59.13,12.8 60.66,12.8 63.25,10.21 66.06,10.21 66.51,9.75 v67.51,9.75 | v77.11,37.49 77.11,38.71 | 48.16,40.54 51.46,40.54 56.34,35.67 69.35,35.67 v71.17,37.49
  Bottom 0.152: 88.96,22.96 ML-300-3P1.P$1
  Bottom 0.305: v67.51,9.75 68.38,9.75 81.59,22.96 82.09,22.96 | 88.96,22.96 82.09,22.96 | 82.09,22.96 77.61,27.43 77.61,36.99 v77.11,37.49 v71.17,37.49
SHB  (via drill 0.3)
  Top 0.152: 77.11,30.48 Q4.6 77.11,30.63 | 77.11,31.85 Q4.7 77.11,31.7 77.11,31.24 | 77.11,32.92 Q4.8 | 74.68,31.24 Q4.9 | 41.76,49.38 R21.2 41.91,49.38 | 34.9,51.82 DRV8300D1.SHB | 56.39,31.85 Q3.2 56.39,31.7 | 56.39,32.92 Q3.1 | 48.01,30.63 C26.1 | 56.24,30.63 Q3.3 56.39,30.63 | 68.89,12.95 C3.2 | 47.85,30.63 C26.1 | 47.85,30.79 C26.1 | 72.39,18.34 72.39,18.44 | 76.96,29.11 Q4.5
  Top 0.254: 51.57,15.39 60.44,15.39
  Top 0.305: 77.11,30.48 77.11,29.26 Q4.5 | 77.11,32.92 77.11,31.85 | 77.11,30.63 77.11,31.24 74.68,31.24 | 41.76,49.38 40.63,49.38 38.2,51.82 34.9,51.82 | 56.39,32.92 56.39,31.85 | 56.24,30.63 55.12,30.63 | 55.12,30.63 48.01,30.63 | 68.89,12.95 62.88,12.95 60.44,15.39 | 51.57,15.39 47.24,19.71 47.24,30.02 47.85,30.63 | 56.39,30.63 56.39,31.7 | 41.91,49.38 44.96,49.38 46.02,50.44 48.47,50.44 49.12,49.79 49.12,46.37 46.03,43.28 46.03,32.6 47.85,30.79 | 76.96,29.11 76.96,28.44 72.39,23.86 72.39,18.44 | 55.12,30.63 55.12,28.85 56.74,27.23 60.64,27.23 70.23,17.64 71.78,17.64 72.39,18.24 72.39,18.34 73.2,17.53 78.7,17.53 v78.79,17.44
  Bottom 0.152: 88.85,13.11 ML-300-3P1.P$3
  Bottom 0.305: 88.85,13.11 83.12,13.11 v78.79,17.44
SHC  (via drill 0.3)
  Top 0.152: 59.89,55.32 R25.2 | 34.9,49.99 DRV8300D1.SHC | 56.39,21.49 Q5.2 56.39,21.34 | 56.39,22.55 Q5.1 56.39,22.71 56.54,22.86 | 56.24,20.27 56.08,20.42 | 48.16,20.42 C29.1 | 56.39,20.27 Q5.3 | 77.11,18.9 Q6.5 77.11,18.75 | 77.11,20.12 Q6.6 77.11,20.27 | 77.11,21.49 Q6.7 77.11,21.34 | 77.11,22.55 Q6.8 | 74.68,20.88 Q6.9 | 79.1,12.8 C4.2 78.94,12.95 | 88.85,3.05 ML-300-3P1.P$5
  Top 0.305: 59.89,55.32 55.52,55.32 v55.02,54.82 | 34.9,49.99 v38.86,49.99 | 56.39,22.55 56.39,21.49 | 56.08,20.42 54.32,20.42 | 54.32,20.42 48.16,20.42 | 56.24,20.27 Q5.3 | 56.39,20.27 56.39,21.34 | 77.11,20.12 77.11,18.9 | 77.11,22.55 77.11,21.49 | 77.11,21.34 77.11,20.88 | 77.11,20.88 77.11,20.27 | 74.68,20.88 77.11,20.88 | 88.85,3.05 79.1,12.8 | 77.11,18.75 77.72,18.75 v78.03,18.44 | 54.32,20.42 54.32,19.29 57.71,15.9 76,15.9 78.94,12.95 | 56.54,22.86 v56.54,23.62
  Bottom 0.305: v38.86,49.99 43.69,54.82 v55.02,54.82 55.02,25.15 v56.54,23.62 | v78.03,18.44 78.03,15.87 89,4.9 ML-300-3P1.P$5
VCC  (via drill 0.3)
  Top 0.152: 65.84,55.47 R26.2 65.99,55.47 | 89.92,55.17 R35.2 | 88.29,46.06 C11.+ | 88.54,33.07 C8.+ | 81.38,2.59 C10.1 | 66.75,5.94 U7.3 66.6,6.1 | 62.03,39.01 Q1.5 62.03,38.86 | 62.03,40.08 Q1.6 62.03,40.23 | 62.03,41.3 Q1.7 62.03,41.45 | 62.03,42.67 Q1.8 | 59.74,40.84 Q1.9 | 62.03,18.9 Q5.5 | 62.03,20.12 Q5.6 62.03,20.27 | 62.03,21.49 Q5.7 62.03,21.34 | 62.03,22.55 Q5.8 | 59.74,20.88 Q5.9 | Q3.8 62.03,32.92 62.03,31.85 Q3.7 62.03,31.7 62.03,31.24 | 62.03,31.24 62.03,30.63 Q3.6 62.03,30.48 62.03,29.26 Q3.5 62.03,29.11 v62.03,28.35 | 62.03,31.24 59.74,31.24 Q3.9
  Top 0.406: v43.59,55.47 42.06,55.47 R22.2 | 65.84,55.47 v64.92,55.47 | 89.92,55.17 88.39,53.65 88.29,53.74 | 88.29,46.06 88.29,53.74 | 88.54,33.07 88.54,45.87 C11.+ | 65.99,55.47 66.9,55.47 67.67,56.24 85.8,56.24 88.29,53.74 | 81.38,2.59 80.77,2.59 78.79,0.61 67.87,0.61 66.75,1.73 66.75,5.94 | 62.03,40.08 62.03,39.01 | 62.03,40.23 62.03,40.84 | 62.03,40.84 62.03,41.3 | 62.03,41.45 62.03,42.67 | 59.74,40.84 62.03,40.84 | 62.03,20.12 62.03,18.9 | 62.03,22.55 62.03,21.49 | 62.03,21.34 62.03,20.88 | 62.03,20.88 62.03,20.27 | 59.74,20.88 62.03,20.88 | v62.03,24.08 Q5.8 | v62.03,37.19 62.03,38.86 | v65.08,7.62 66.6,6.1
  Bottom 0.152: v64.92,55.47 64.77,55.63 | 17.22,12.34 J7.2
  Bottom 0.406: v43.59,55.47 54.71,55.47 54.86,55.63 56.84,55.63 | 64.77,55.63 56.84,55.63 | 62.03,24.81 v62.03,28.35 62.53,28.85 62.53,36.69 v62.03,37.19 | 62.03,24.81 v62.03,24.08 63.03,23.08 63.03,18.37 58.67,14.02 | 17.22,12.34 57,12.34 58.67,14.02 | 58.67,14.02 v65.08,7.62 | 56.84,55.63 56.84,27.6 59.63,24.81 62.03,24.81
VIOUT
  Top 0.152: U$1.12 25.91,30.94 15.24,30.94 12.95,28.65 9.6,28.65 7.16,31.09 7.16,39.62 8.99,41.45 JP1.2

### Text on the board
tPlace: BLDC_test1 | suzuki 2023_03